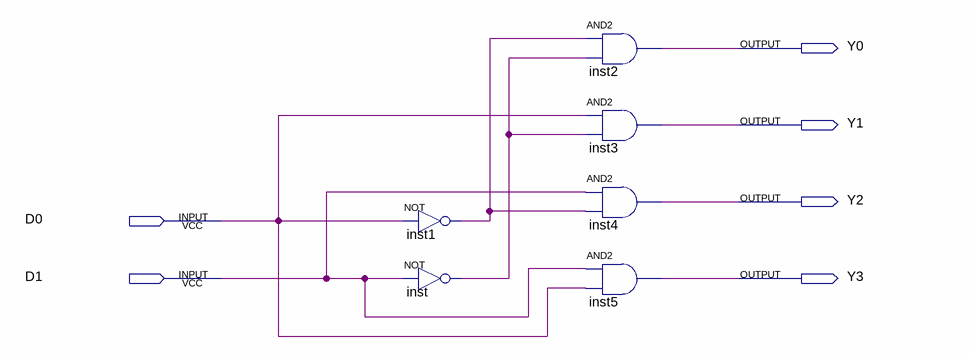
[diagram p0: schematic sheet]
// Quartus schematic 2-4.bdf as structural Verilog: 6 symbols, 6 pins
module \2-4  (
  input  D0,
  input  D1,
  output Y0,
  output Y1,
  output Y2,
  output Y3
);

  wire inst1_out, inst_out;

  not inst1 (inst1_out, D0);
  not inst (inst_out, D1);
  and inst2 (Y0, inst1_out, inst_out);
  and inst3 (Y1, D0, inst_out);
  and inst4 (Y2, D1, inst1_out);
  and inst5 (Y3, D1, D0);
endmodule
